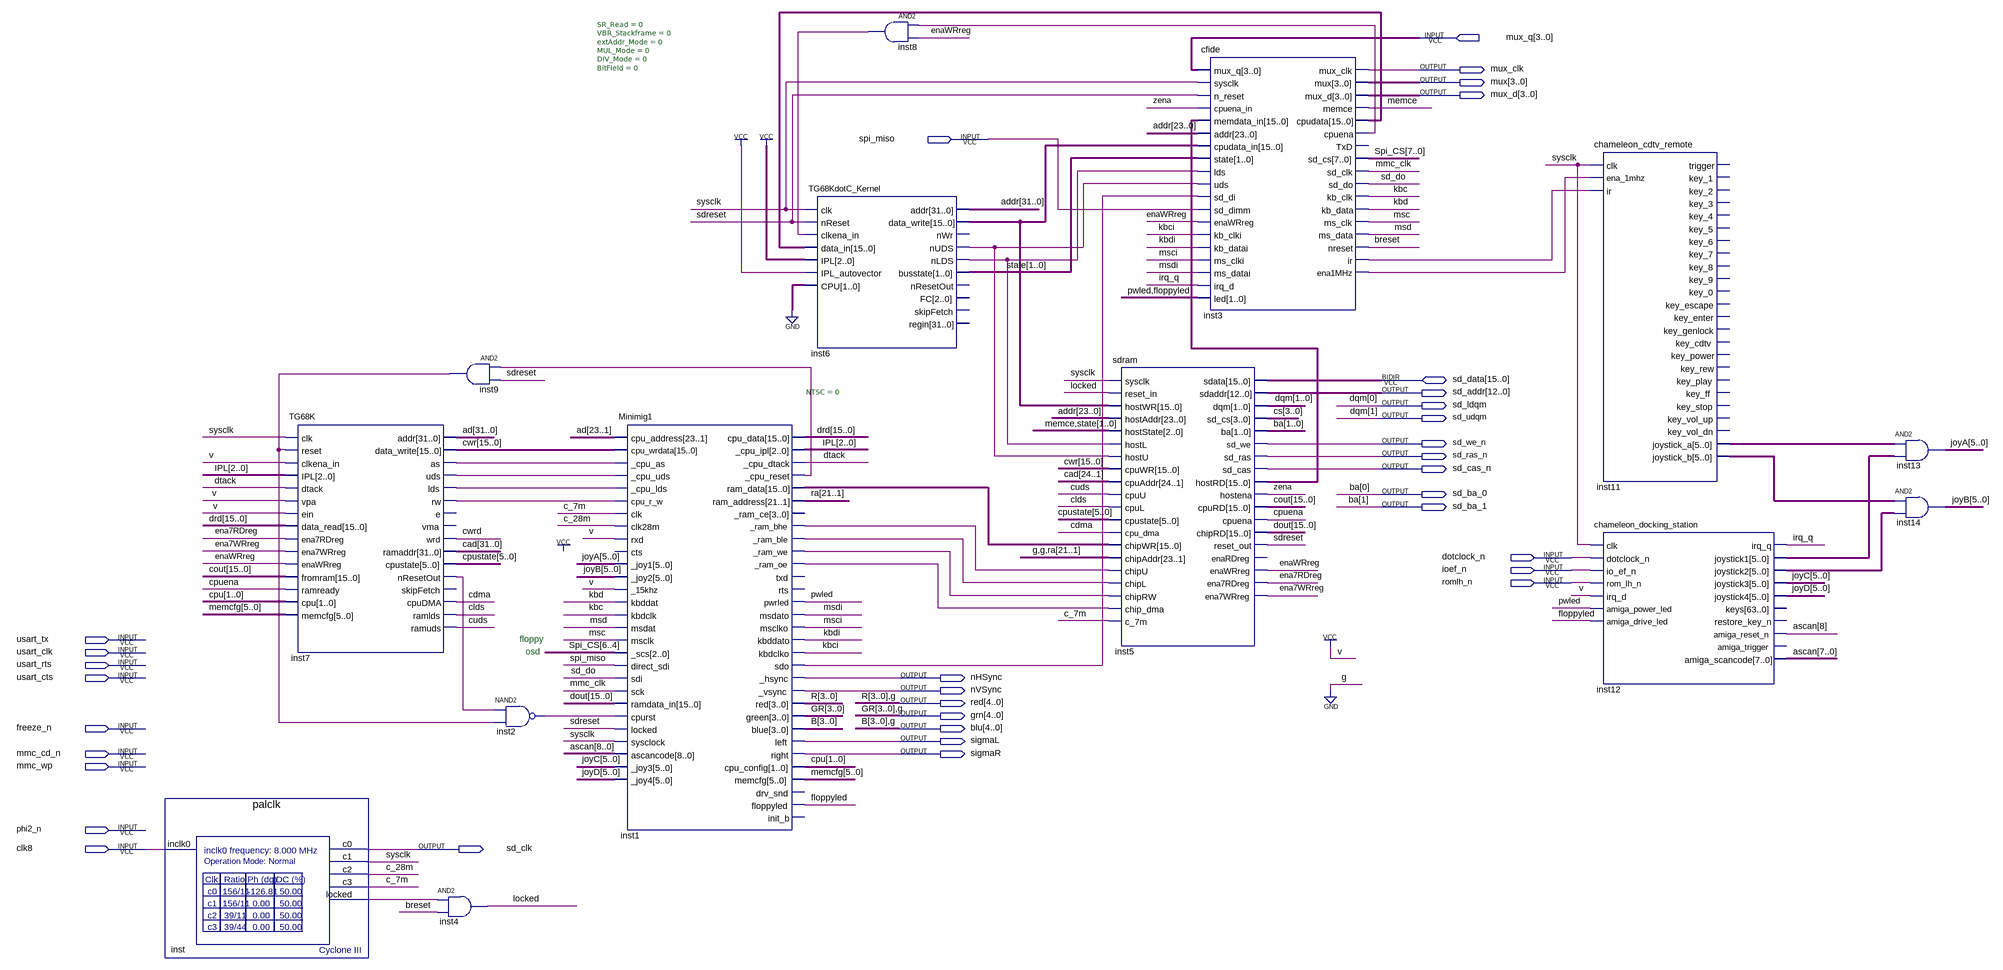
[diagram p0: schematic sheet]
// Quartus schematic fampiga_top.bdf as structural Verilog: 14 symbols, 34 pins
module fampiga_top (
  input  [3:0] mux_q,
  input  spi_miso,
  input  dotclock_n,
  input  ioef_n,
  input  romlh_n,
  input  usart_tx,
  input  usart_clk,
  input  usart_rts,
  input  usart_cts,
  input  freeze_n,
  input  mmc_cd_n,
  input  mmc_wp,
  input  phi2_n,
  input  clk8,
  inout  [15:0] sd_data,
  output mux_clk,
  output [3:0] mux,
  output [3:0] mux_d,
  output [12:0] sd_addr,
  output sd_ldqm,
  output sd_udqm,
  output sd_we_n,
  output sd_ras_n,
  output sd_cas_n,
  output sd_ba_0,
  output sd_ba_1,
  output nHSync,
  output nVSync,
  output [4:0] red,
  output [4:0] grn,
  output [4:0] blu,
  output sigmaL,
  output sigmaR,
  output sd_clk
);

  wire breset, c_7m, c_28m, cdma, clds, cpuena, cuds, cwrd, dtack, ena7RDreg, ena7WRreg, enaWRreg, floppyled,
       inst1__cpu_reset, inst1__ram_bhe, inst1__ram_ble, inst1__ram_oe, inst1__ram_we, inst1_sdo, inst2_out,
       inst3_cpuena, inst3_ena1mhz, inst3_ir, inst6_nlds, inst6_nuds, inst7_as, inst7_lds, inst7_nresetout,
       inst7_rw, inst7_uds, inst8_out, inst9_out, inst_locked, irq_q, kbc, kbci, kbd, kbdi, locked, memce,
       mmc_clk, msc, msci, msd, msdi, pwled, sd_do, sdreset, sysclk, zena;
  wire [1:0] cpu, state;
  wire [2:0] IPL;
  wire [3:0] cs;
  wire [5:0] cpustate, inst11_joystick_a, inst11_joystick_b, inst12_joystick1, inst12_joystick2, joyA, joyB,
       joyC, joyD, memcfg;
  wire [7:0] Spi_CS;
  wire [8:0] ascan;
  wire [15:0] cout, cwr, dout, drd, inst1_ram_data, inst3_cpudata, inst5_hostrd, inst6_data_write;
  wire [21:1] ra;
  wire [31:0] ad, addr, cad;

  palclk inst (.inclk0(clk8), .c0(sd_clk), .c1(sysclk), .c2(c_28m), .c3(c_7m), .locked(inst_locked));
  TG68K inst7 (
    .clk(sysclk), .reset(inst9_out), .clkena_in(1'b1), .IPL(IPL), .dtack(dtack), .vpa(1'b1), .ein(1'b1),
    .data_read(drd), .ena7RDreg(ena7RDreg), .ena7WRreg(ena7WRreg), .enaWRreg(enaWRreg), .fromram(cout),
    .ramready(cpuena), .cpu(cpu), .memcfg(memcfg), .addr(ad), .data_write(cwr), .as(inst7_as),
    .uds(inst7_uds), .lds(inst7_lds), .rw(inst7_rw), .wrd(cwrd), .ramaddr(cad), .cpustate(cpustate),
    .nResetOut(inst7_nresetout), .cpuDMA(cdma), .ramlds(clds), .ramuds(cuds));  // open: e, vma, skipFetch
  and inst4 (locked, inst_locked, breset);
  and inst9 (inst9_out, inst1__cpu_reset, sdreset);
  nand inst2 (inst2_out, inst7_nresetout, inst9_out);
  Minimig1 #(.NTSC(0)) inst1 (
    .cpu_address(ad[23:1]), .cpu_wrdata(cwr), ._cpu_as(inst7_as), ._cpu_uds(inst7_uds), ._cpu_lds(inst7_lds),
    .cpu_r_w(inst7_rw), .clk(c_7m), .clk28m(c_28m), .rxd(1'b1), ._joy1(joyA), ._joy2(joyB), ._15khz(1'b1),
    .kbddat(kbd), .kbdclk(kbc), .msdat(msd), .msclk(msc), ._scs(Spi_CS[6:4]), .direct_sdi(spi_miso),
    .sdi(sd_do), .sck(mmc_clk), .ramdata_in(dout), .cpurst(inst2_out), .locked(sdreset), .sysclock(sysclk),
    .ascancode(ascan), ._joy3(joyC), ._joy4(joyD), .cpu_data(drd), ._cpu_ipl(IPL), ._cpu_dtack(dtack),
    ._cpu_reset(inst1__cpu_reset), .ram_data(inst1_ram_data), .ram_address(ra), ._ram_bhe(inst1__ram_bhe),
    ._ram_ble(inst1__ram_ble), ._ram_we(inst1__ram_we), ._ram_oe(inst1__ram_oe), .pwrled(pwled),
    .msdato(msdi), .msclko(msci), .kbddato(kbdi), .kbdclko(kbci), ._hsync(nHSync), ._vsync(nVSync),
    .red(red[4:1]), .green(grn[4:1]), .blue(blu[4:1]), .left(sigmaL), .right(sigmaR), .cpu_config(cpu),
    .memcfg(memcfg), .floppyled(floppyled), .sdo(inst1_sdo));  // open: cts, _ram_ce, txd, rts, drv_snd, init_b
  TG68KdotC_Kernel #(.SR_Read(0), .VBR_Stackframe(0), .extAddr_Mode(0), .MUL_Mode(0), .DIV_Mode(0), .BitField(0)) inst6 (
    .clk(sysclk), .nReset(sdreset), .clkena_in(inst8_out), .data_in(inst3_cpudata), .IPL(3'b111),
    .IPL_autovector(1'b1), .CPU(2'b00), .addr(addr), .data_write(inst6_data_write), .nUDS(inst6_nuds),
    .nLDS(inst6_nlds), .busstate(state));  // open: nWr, nResetOut, FC, skipFetch, regin
  and inst8 (inst8_out, inst3_cpuena, enaWRreg);
  sdram inst5 (
    .sysclk(sysclk), .reset_in(locked), .hostWR(inst6_data_write), .hostAddr(addr[23:0]),
    .hostState({memce, state}), .hostL(inst6_nlds), .hostU(inst6_nuds), .cpuWR(cwr), .cpuAddr(cad[24:1]),
    .cpuU(cuds), .cpuL(clds), .cpustate(cpustate), .cpu_dma(cdma), .chipWR(inst1_ram_data),
    .chipAddr({2'b00, ra}), .chipU(inst1__ram_bhe), .chipL(inst1__ram_ble), .chipRW(inst1__ram_we),
    .chip_dma(inst1__ram_oe), .c_7m(c_7m), .sdaddr(sd_addr), .dqm({sd_udqm, sd_ldqm}), .sd_cs(cs),
    .ba({sd_ba_1, sd_ba_0}), .sd_we(sd_we_n), .sd_ras(sd_ras_n), .sd_cas(sd_cas_n), .hostRD(inst5_hostrd),
    .hostena(zena), .cpuRD(cout), .cpuena(cpuena), .chipRD(dout), .reset_out(sdreset), .enaWRreg(enaWRreg),
    .ena7RDreg(ena7RDreg), .ena7WRreg(ena7WRreg), .sdata(sd_data));  // open: enaRDreg
  cfide inst3 (
    .mux_q(mux_q), .sysclk(sysclk), .n_reset(sdreset), .cpuena_in(zena), .memdata_in(inst5_hostrd),
    .addr(addr[23:0]), .cpudata_in(inst6_data_write), .state(state), .lds(inst6_nlds), .uds(inst6_nuds),
    .sd_di(inst1_sdo), .sd_dimm(spi_miso), .enaWRreg(enaWRreg), .kb_clki(kbci), .kb_datai(kbdi),
    .ms_clki(msci), .ms_datai(msdi), .irq_d(irq_q), .led({pwled, floppyled}), .mux_clk(mux_clk), .mux(mux),
    .mux_d(mux_d), .memce(memce), .cpudata(inst3_cpudata), .cpuena(inst3_cpuena), .sd_cs(Spi_CS),
    .sd_clk(mmc_clk), .sd_do(sd_do), .kb_clk(kbc), .kb_data(kbd), .ms_clk(msc), .ms_data(msd),
    .nreset(breset), .ir(inst3_ir), .ena1MHz(inst3_ena1mhz));  // open: TxD
  chameleon_cdtv_remote inst11 (
    .clk(sysclk), .ena_1mhz(inst3_ena1mhz), .ir(inst3_ir), .joystick_a(inst11_joystick_a),
    .joystick_b(inst11_joystick_b));  // open: trigger, key_1, key_2, key_3, key_4, key_5, key_6, key_7, key_8, key_9, key_0, key_escape, key_enter, key_genlock, key_cdtv, key_power, key_rew, key_play, key_ff, key_stop, key_vol_up, key_vol_dn
  chameleon_docking_station inst12 (
    .clk(sysclk), .dotclock_n(dotclock_n), .io_ef_n(ioef_n), .rom_lh_n(romlh_n), .irq_d(1'b1),
    .amiga_power_led(pwled), .amiga_drive_led(floppyled), .irq_q(irq_q), .joystick1(inst12_joystick1),
    .joystick2(inst12_joystick2), .joystick3(joyC), .joystick4(joyD), .amiga_reset_n(ascan[8]),
    .amiga_scancode(ascan[7:0]));  // open: keys, restore_key_n, amiga_trigger
  assign joyA = inst11_joystick_a & inst12_joystick1;  // AND2 inst13, 6 bits wide
  assign joyB = inst11_joystick_b & inst12_joystick2;  // AND2 inst14, 6 bits wide

  assign blu[0] = 1'b0;
  assign grn[0] = 1'b0;
  assign red[0] = 1'b0;

  // Other names for the same wires on the sheet: B[3:0] = blu[4:1]; ba[1:0] = {sd_ba_1, sd_ba_0};
  //   dqm[1:0] = {sd_udqm, sd_ldqm}; GR[3:0] = grn[4:1]; R[3:0] = red[4:1]

  // Notes on the sheet:
  //   floppy
  //   osd
endmodule
